# EAGLE design unixtimeclock (EAGLE 6.4)
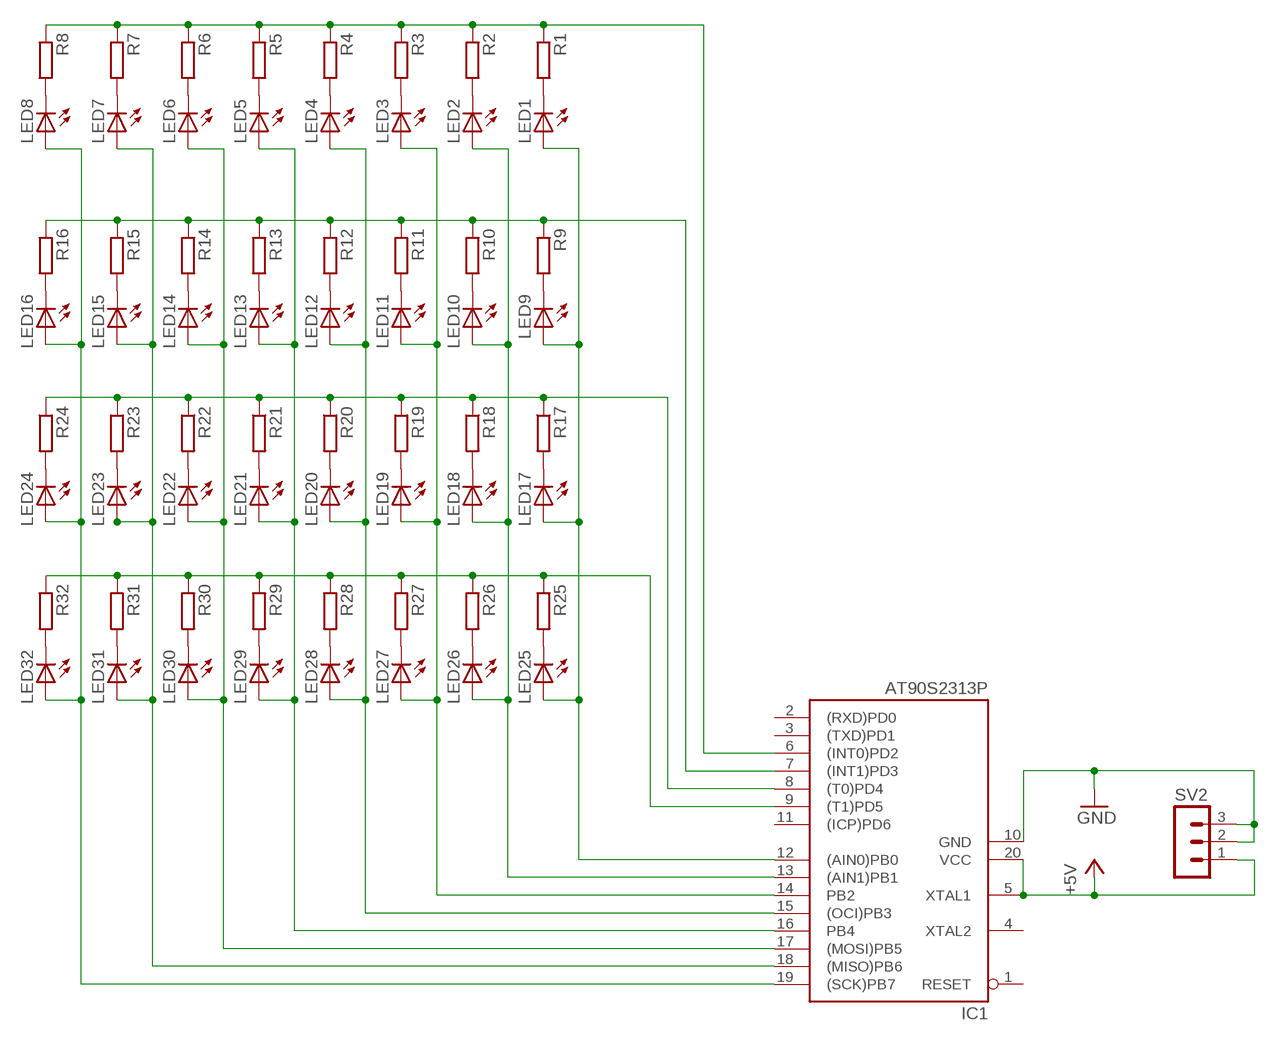
[diagram p0: schematic, sheet 1]

## Parts
IC1  AT90S2313P  [DIL20]
LED1  LED5MM  [LED5MM]
LED2  LED5MM  [LED5MM]
LED3  LED5MM  [LED5MM]
LED4  LED5MM  [LED5MM]
LED5  LED5MM  [LED5MM]
LED6  LED5MM  [LED5MM]
LED7  LED5MM  [LED5MM]
LED8  LED5MM  [LED5MM]
LED9  LED5MM  [LED5MM]
LED10  LED5MM  [LED5MM]
LED11  LED5MM  [LED5MM]
LED12  LED5MM  [LED5MM]
LED13  LED5MM  [LED5MM]
LED14  LED5MM  [LED5MM]
LED15  LED5MM  [LED5MM]
LED16  LED5MM  [LED5MM]
LED17  LED5MM  [LED5MM]
LED18  LED5MM  [LED5MM]
LED19  LED5MM  [LED5MM]
LED20  LED5MM  [LED5MM]
LED21  LED5MM  [LED5MM]
LED22  LED5MM  [LED5MM]
LED23  LED5MM  [LED5MM]
LED24  LED5MM  [LED5MM]
LED25  LED5MM  [LED5MM]
LED26  LED5MM  [LED5MM]
LED27  LED5MM  [LED5MM]
LED28  LED5MM  [LED5MM]
LED29  LED5MM  [LED5MM]
LED30  LED5MM  [LED5MM]
LED31  LED5MM  [LED5MM]
LED32  LED5MM  [LED5MM]
R1  R-EU_0207/10  [0207/10]
R2  R-EU_0207/10  [0207/10]
R3  R-EU_0207/10  [0207/10]
R4  R-EU_0207/10  [0207/10]
R5  R-EU_0207/10  [0207/10]
R6  R-EU_0207/10  [0207/10]
R7  R-EU_0207/10  [0207/10]
R8  R-EU_0207/10  [0207/10]
R9  R-EU_0207/10  [0207/10]
R10  R-EU_0207/10  [0207/10]
R11  R-EU_0207/10  [0207/10]
R12  R-EU_0207/10  [0207/10]
R13  R-EU_0207/10  [0207/10]
R14  R-EU_0207/10  [0207/10]
R15  R-EU_0207/10  [0207/10]
R16  R-EU_0207/10  [0207/10]
R17  R-EU_0207/10  [0207/10]
R18  R-EU_0207/10  [0207/10]
R19  R-EU_0207/10  [0207/10]
R20  R-EU_0207/10  [0207/10]
R21  R-EU_0207/10  [0207/10]
R22  R-EU_0207/10  [0207/10]
R23  R-EU_0207/10  [0207/10]
R24  R-EU_0207/10  [0207/10]
R25  R-EU_0207/10  [0207/10]
R26  R-EU_0207/10  [0207/10]
R27  R-EU_0207/10  [0207/10]
R28  R-EU_0207/10  [0207/10]
R29  R-EU_0207/10  [0207/10]
R30  R-EU_0207/10  [0207/10]
R31  R-EU_0207/10  [0207/10]
R32  R-EU_0207/10  [0207/10]
SV2  MA03-1  [MA03-1]

## Nets
+5V: IC1.5(XTAL1) IC1.20(VCC) SV2.1
GND: IC1.10(GND) SV2.2 SV2.3
N$1: LED25.K(C) R25.2
N$2: LED26.K(C) R26.2
N$3: LED27.K(C) R27.2
N$4: LED28.K(C) R28.2
N$5: LED29.K(C) R29.2
N$6: LED30.K(C) R30.2
N$7: LED31.K(C) R31.2
N$8: LED32.K(C) R32.2
N$9: LED17.K(C) R17.2
N$10: LED18.K(C) R18.2
N$11: LED19.K(C) R19.2
N$12: LED20.K(C) R20.2
N$13: LED21.K(C) R21.2
N$14: LED22.K(C) R22.2
N$15: LED23.K(C) R23.2
N$16: LED24.K(C) R24.2
N$17: IC1.6((INT0)PD2) R1.1 R2.1 R3.1 R4.1 R5.1 R6.1 R7.1 R8.1
N$18: LED9.K(C) R9.2
N$19: LED10.K(C) R10.2
N$20: LED11.K(C) R11.2
N$21: LED12.K(C) R12.2
N$22: LED13.K(C) R13.2
N$23: LED14.K(C) R14.2
N$24: LED15.K(C) R15.2
N$25: LED16.K(C) R16.2
N$26: LED1.K(C) R1.2
N$27: LED2.K(C) R2.2
N$28: LED3.K(C) R3.2
N$29: LED4.K(C) R4.2
N$30: LED5.K(C) R5.2
N$31: LED6.K(C) R6.2
N$32: LED7.K(C) R7.2
N$33: LED8.K(C) R8.2
N$34: IC1.7((INT1)PD3) R9.1 R10.1 R11.1 R12.1 R13.1 R14.1 R15.1 R16.1
N$35: IC1.8((T0)PD4) R17.1 R18.1 R19.1 R20.1 R21.1 R22.1 R23.1 R24.1
N$36: IC1.9((T1)PD5) R25.1 R26.1 R27.1 R28.1 R29.1 R30.1 R31.1 R32.1
N$37: IC1.19((SCK)PB7) LED8.A LED16.A LED24.A LED32.A
N$39: IC1.17((MOSI)PB5) LED6.A LED14.A LED22.A LED30.A
N$40: IC1.16(PB4) LED5.A LED13.A LED21.A LED29.A
N$41: IC1.15((OCI)PB3) LED4.A LED12.A LED20.A LED28.A
N$42: IC1.14(PB2) LED3.A LED11.A LED19.A LED27.A
N$43: IC1.13((AIN1)PB1) LED2.A LED10.A LED18.A LED26.A
N$44: IC1.12((AIN0)PB0) LED1.A LED9.A LED17.A LED25.A
N$68: IC1.18((MISO)PB6) LED7.A LED15.A LED23.A LED31.A
Unconnected: IC1.1(RESET) IC1.2((RXD)PD0) IC1.3((TXD)PD1) IC1.4(XTAL2) IC1.11((ICP)PD6)

## Library data of the parts
IC1 = atmel:AT90S2313: MICROCONTROLLER 2 Kbytes FLASH 128 bytes SRAM 128 bytes EEPROM UART; OC_FARNELL: unknown; OC_NEWARK: unknown
LED1-LED32 = led:LED: LED OSRAM: - CHIPLED LG R971, LG N971, LY N971, LG Q971, LY Q971, LO R971, LY R971 LH N974, LH R974 LS Q976, LO Q976, LY Q976 LO Q996 - Hyper CHIPLED LW Q18S LB Q993, LB Q99A, LB R99A - SideLED LS A670, LO A670, LY A670, LG A670, LP A670 LB A673, LV A673, LT A673, LW A673 LH A674 LY A675 LS A676, LA A676, LO A676, LY A676, LW A676 LS A679, LY A679, LG A679 - Hyper Micro SIDELED® LS Y876, LA Y876, LO Y876, LY Y876 LT Y87S - SmartLED LW L88C, LW L88S LB L89C, LB L89S, LG L890 LS L89K, LO L89K, LY L89K LS L896, LA L896, LO L896, LY L896 - TOPLED LS T670, LO T670, LY T670, LG T670, LP T670 LSG T670, LSP T670, LSY T670, LOP T670, LYG T670 LG T671, LOG T671, LSG T671 LB T673, LV T673, LT T673, LW T673 LH T674 LS T676, LA T676, LO T676, LY T676, LB T676, LH T676, LSB T676, LW T676 LB T67C, LV T67C, LT T67C, LS T67K, LO T67K, LY T67K, LW E67C LS E67B, LA E67B, LO E67B, LY E67B, LB E67C, LV E67C, LT E67C LW T67C LS T679, LY T679, LG T679 LS T770, LO T770, LY T770, LG T770, LP T770 LB T773, LV T773, LT T773, LW T773 LH T774 LS E675, LA E675, LY E675, LS T675 LS T776, LA T776, LO T776, LY T776, LB T776 LHGB T686 LT T68C, LB T68C - Hyper Mini TOPLED® LB M676 - Mini TOPLED Santana® LG M470 LS M47K, LO M47K, LY M47K Source: http://www.osram.convergy.de LUXEON: - LUMILED® LXK2-PW12-R00, LXK2-PW12-S00, LXK2-PW14-U00, LXK2-PW14-V00 LXK2-PM12-R00, LXK2-PM12-S00, LXK2-PM14-U00 LXK2-PE12-Q00, LXK2-PE12-R00, LXK2-PE12-S00, LXK2-PE14-T00, LXK2-PE14-U00 LXK2-PB12-K00, LXK2-PB12-L00, LXK2-PB12-M00, LXK2-PB14-N00, LXK2-PB14-P00, LXK2-PB14-Q00 LXK2-PR12-L00, LXK2-PR12-M00, LXK2-PR14-Q00, LXK2-PR14-R00 LXK2-PD12-Q00, LXK2-PD12-R00, LXK2-PD12-S00 LXK2-PH12-R00, LXK2-PH12-S00 LXK2-PL12-P00, LXK2-PL12-Q00, LXK2-PL12-R00 Source: www.luxeon.com KINGBRIGHT: KA-3528ASYC Source: www.kingbright.com
R1-R32 = rcl:R-EU_: RESISTOR, European symbol
SV2 = con-lstb:MA03-1: PIN HEADER; OC_FARNELL: unknown; OC_NEWARK: unknown

## Board
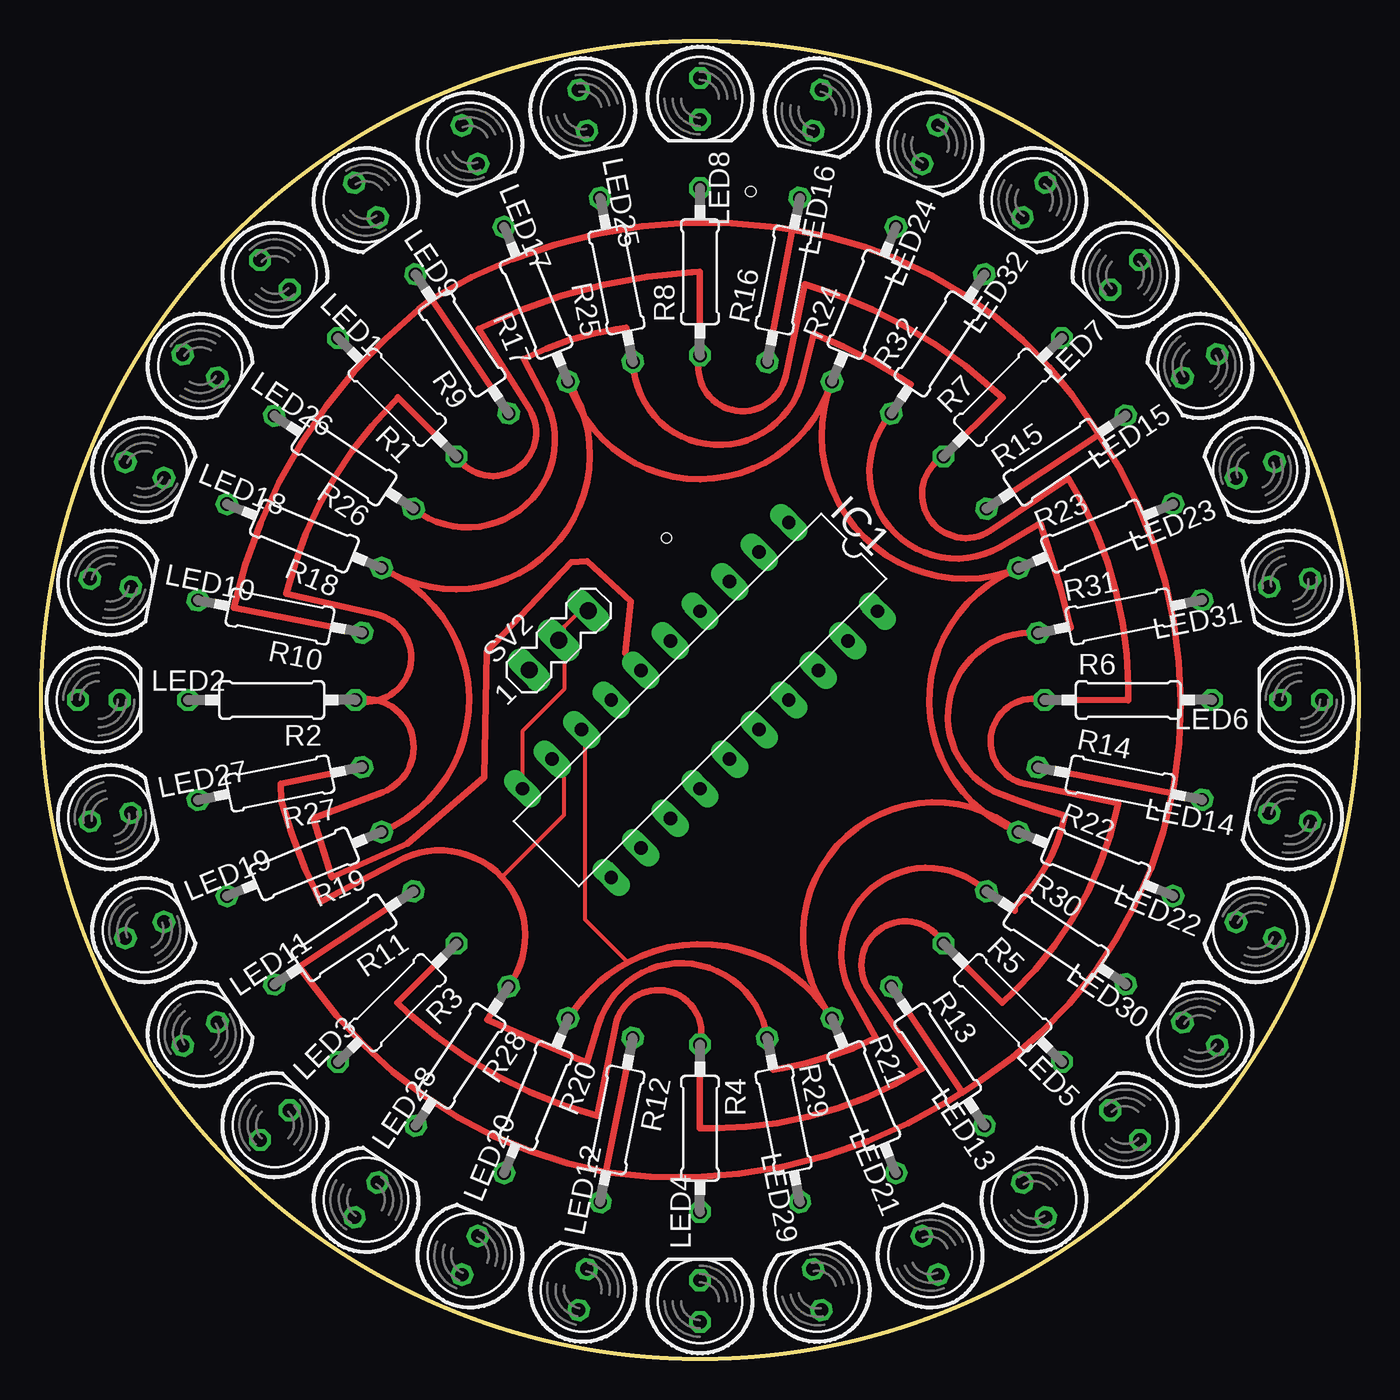
[diagram p1: board, top side]
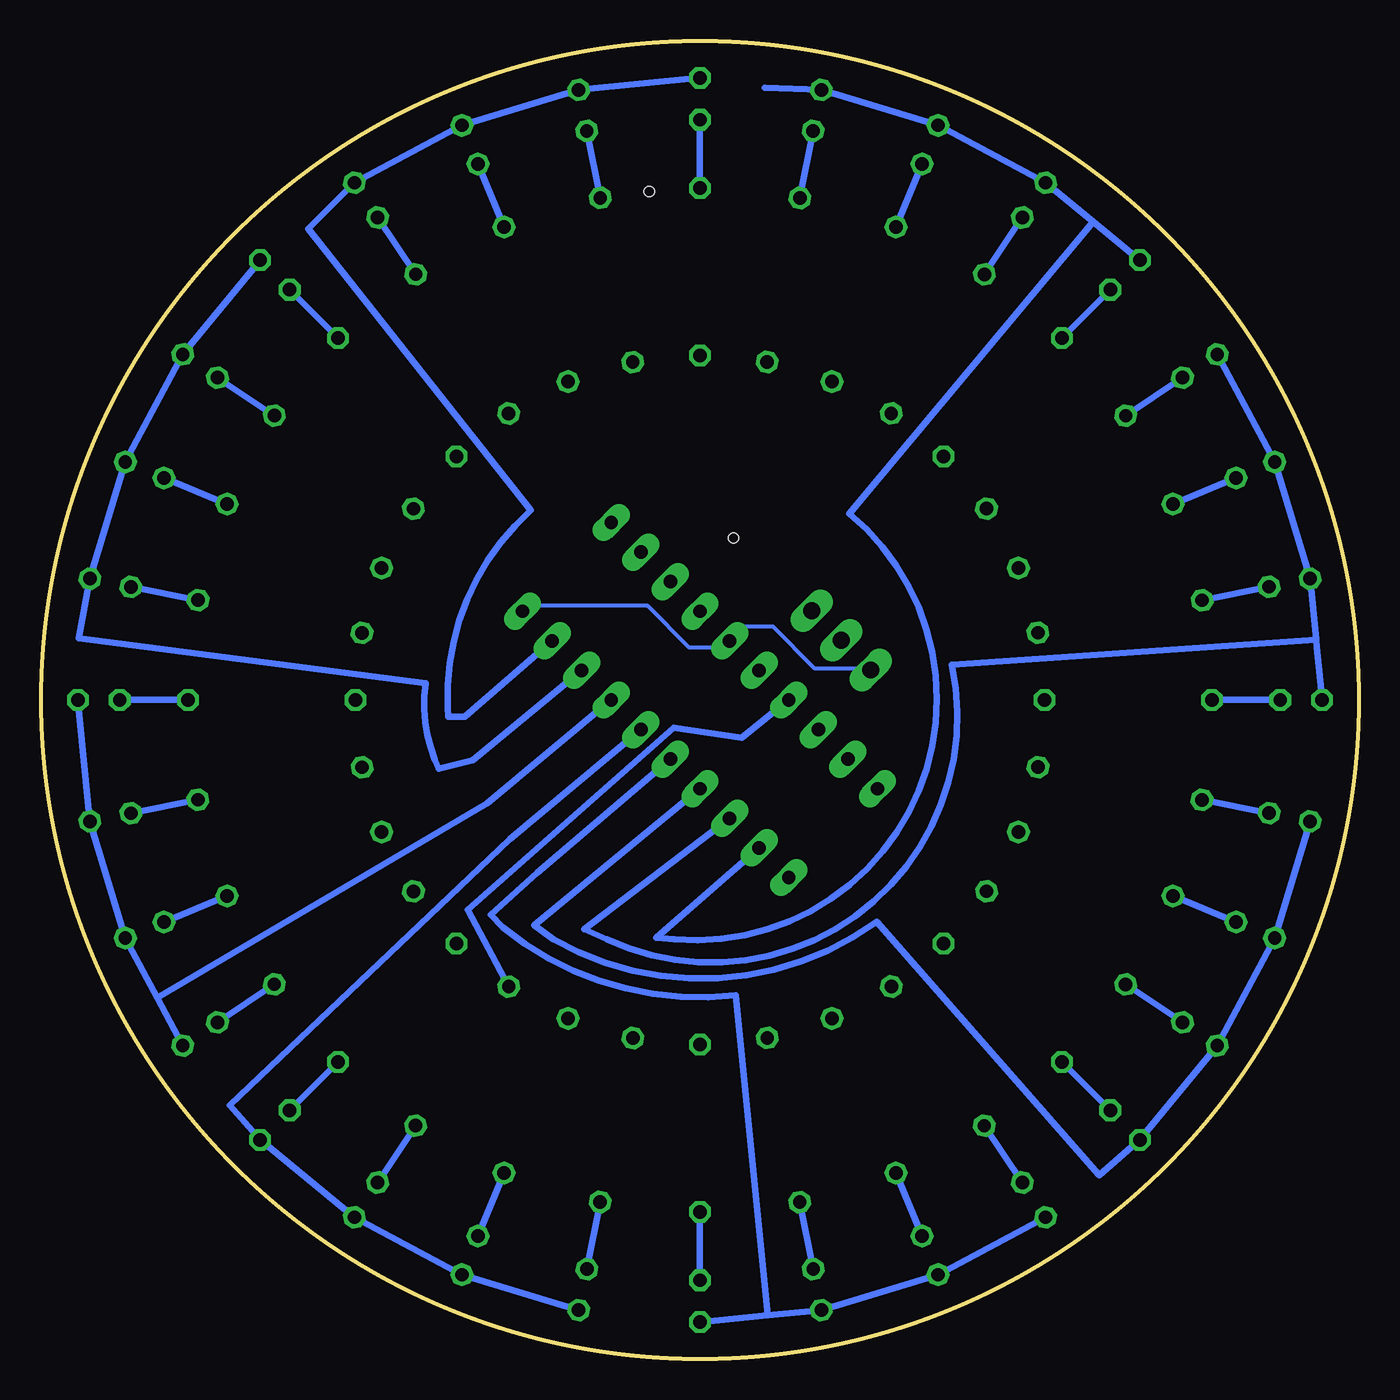
[diagram p2: board, bottom side, seen from below]

Size 80 x 80 mm. Coordinates in mm from the lower left corner, seen from the top.
Outline: circle at 40,40 radius 40
Copper layers (1*16): Top 0.035mm / dielectric 1.5mm / Bottom 0.035mm
Design rules "default": minimum track width 10mil, minimum drill 24mil, track to track 8mil, track to pad 8mil, pad to pad 8mil, via to via 8mil, smd to smd 8mil, copper to edge 40mil, drill to drill 8mil, minimum pad ring 10mil, minimum via ring 8mil, stop-mask expansion 4mil, vias tented up to drill 0mil, thermal gap 10mil
Holes 0.6 mm at 37.96,49.84 43.08,70.88

### Footprints (pad centres in the part's own frame; a part is rotated, then mirrored left to right if it is on the bottom)
DIL20 = drill 0.813 long: 1 -11.43,-3.81; 2 -8.89,-3.81; 3 -6.35,-3.81; 4 -3.81,-3.81; 5 -1.27,-3.81; 6 1.27,-3.81; 7 3.81,-3.81; 8 6.35,-3.81; 9 8.89,-3.81; 10 11.43,-3.81; 11 11.43,3.81; 12 8.89,3.81; 13 6.35,3.81; 14 3.81,3.81; 15 1.27,3.81; 16 -1.27,3.81; 17 -3.81,3.81; 18 -6.35,3.81; 19 -8.89,3.81; 20 -11.43,3.81
LED5MM = drill 0.813 octagon: A -1.27,0; K 1.27,0
0207/10 = drill 0.813 octagon: 1 -5.08,0; 2 5.08,0
MA03-1 = drill 1.016 long: 1 -2.54,0; 2 0,0; 3 2.54,0

### Placement (x,y rotation side)
IC1  40,40 225 top
LED1  14.19,65.81 315 top
LED2  3.5,40 0 top
LED3  14.19,14.19 45 top
LED4  40,3.5 90 top
LED5  65.81,14.19 135 top
LED6  76.5,40 180 top
LED7  65.81,65.81 225 top
LED8  40,76.5 270 top
LED9  19.72,70.35 303.8 top
LED10  4.2,47.12 348.8 top
LED11  9.65,19.72 33.8 top
LED12  32.88,4.2 78.8 top
LED13  60.28,9.65 123.8 top
LED14  75.8,32.88 168.8 top
LED15  70.35,60.28 213.8 top
LED16  47.12,75.8 258.8 top
LED17  26.03,73.72 292.5 top
LED18  6.28,53.97 337.5 top
LED19  6.28,26.03 22.5 top
LED20  26.03,6.28 67.5 top
LED21  53.97,6.28 112.5 top
LED22  73.72,26.03 157.5 top
LED23  73.72,53.97 202.5 top
LED24  53.97,73.72 247.5 top
LED25  32.88,75.8 281.3 top
LED26  9.65,60.28 326.3 top
LED27  4.2,32.88 11.3 top
LED28  19.72,9.65 56.3 top
LED29  47.12,4.2 101.3 top
LED30  70.35,19.72 146.3 top
LED31  75.8,47.12 191.3 top
LED32  60.28,70.35 236.3 top
R1  21.62,58.38 135 top
R2  14,40 180 top
R3  21.62,21.62 225 top
R4  40,14 270 top
R5  58.38,21.62 315 top
R6  66,40 0 top
R7  58.38,58.38 45 top
R8  40,66 90 top
R9  25.56,61.62 123.8 top
R10  14.5,45.07 168.8 top
R11  18.38,25.56 213.8 top
R12  34.93,14.5 258.8 top
R13  54.44,18.38 303.8 top
R14  65.5,34.93 348.8 top
R15  61.62,54.44 33.8 top
R16  45.07,65.5 78.8 top
R17  30.05,64.02 112.5 top
R18  15.98,49.95 157.5 top
R19  15.98,30.05 202.5 top
R20  30.05,15.98 247.5 top
R21  49.95,15.98 292.5 top
R22  64.02,30.05 337.5 top
R23  64.02,49.95 22.5 top
R24  49.95,64.02 67.5 top
R25  34.93,65.5 101.3 top
R26  18.38,54.44 146.3 top
R27  14.5,34.93 191.3 top
R28  25.56,18.38 236.3 top
R29  45.07,14.5 281.3 top
R30  61.62,25.56 326.3 top
R31  65.5,45.07 11.3 top
R32  54.44,61.62 56.3 top
SV2  31.42,43.62 45 top

### Tracks (layer width: path | path; a pad name or v marks a point on that pad's centre or on a via)
+5V
  Bottom 0.254: SV2.1 30.48,41.91 33.02,41.91 35.56,44.45 38.1,44.45 IC1.5 38.1,43.18 40.64,43.18 43.18,45.72 50.8,45.72 IC1.20
GND
  Top 0.254: 31.75,43.18 31.75,40.64 29.21,38.1 29.21,34.29 IC1.10 | 31.75,43.18 31.75,44.45 33.02,45.72 SV2.3 | 31.75,43.18 SV2.2
N$1
  Bottom 0.406: R25.2 LED25.K
N$2
  Bottom 0.406: LED26.K R26.2
N$3
  Bottom 0.406: LED27.K R27.2
N$4
  Bottom 0.406: LED28.K R28.2
N$5
  Bottom 0.406: LED29.K R29.2
N$6
  Bottom 0.406: R30.2 LED30.K
N$7
  Bottom 0.406: R31.2 LED31.K
N$8
  Bottom 0.406: LED32.K R32.2
N$9
  Bottom 0.406: R17.2 LED17.K
N$10
  Bottom 0.406: LED18.K R18.2
N$11
  Bottom 0.406: R19.2 LED19.K
N$12
  Bottom 0.406: LED20.K R20.2
N$13
  Bottom 0.406: R21.2 LED21.K
N$14
  Bottom 0.406: R22.2 LED22.K
N$15
  Bottom 0.406: R23.2 LED23.K
N$16
  Bottom 0.406: R24.2 LED24.K
N$17
  Top 0.254: 21.59,40.64 21.61,40.62
  Top 0.406: R3.1 21.61,21.62 22.3,20.98 arc28 33.77,14.77 34.89,20.29 arc-184 R4.1 40,14 40.9,14 arc32 53.52,17.65 50.27,22.38 arc-185 R5.1 54.79,25.17 58.35,21.61 59.02,22.25 arc35 65.39,33.73 59.72,34.92 arc-183 R6.1 66.01,40 66,40.9 arc31 62.35,53.48 57.63,50.29 arc-183 R7.1 58.37,58.35 57.78,58.88 arc25 46.37,65.24 45.19,59.66 arc-184 R8.1 39.98,66.01 39.48,65.98 arc23 26.58,62.54 29.65,57.64 arc-179 R1.1 25.21,54.82 21.65,58.38 21.65,58.32 21.4,58.07 arc32 14.89,46.44 20.38,45.2 arc-124 21.61,40.62 arc-58 R2.1 arc-171 20.73,34.41 16.53,32.81 17.64,29.23 22.22,31.28 26.91,35.31 27.06,42.94 32.2,48.38 33.16,48.41 35.81,45.99 35.47,42.83 IC1.6
N$18
  Bottom 0.406: R9.2 LED9.K
N$19
  Bottom 0.406: LED10.K R10.2
N$20
  Bottom 0.406: LED11.K R11.2
N$21
  Bottom 0.406: LED12.K R12.2
N$22
  Bottom 0.406: R13.2 LED13.K
N$23
  Bottom 0.406: R14.2 LED14.K
N$24
  Bottom 0.406: R15.2 LED15.K
N$25
  Bottom 0.406: R16.2 LED16.K
N$26
  Bottom 0.406: LED1.K R1.2
N$27
  Bottom 0.406: LED2.K R2.2
N$28
  Bottom 0.406: LED3.K R3.2
N$29
  Bottom 0.406: R4.2 LED4.K
N$30
  Bottom 0.406: R5.2 LED5.K
N$31
  Bottom 0.406: R6.2 LED6.K
N$32
  Bottom 0.406: LED7.K R7.2
N$33
  Bottom 0.406: R8.2 LED8.K
N$34
  Top 0.406: R10.1 11.69,45.6 arc-38 22.94,63.71 23.72,64.33 R9.1 23.73,64.34 arc-39 44.63,68.69 45.6,68.56 R16.1 45.59,68.56 arc-50 63.88,56.64 64.22,56.11 R15.1 64.22,56.11 arc-43 68.78,34.95 68.68,34.33 R14.1 68.68,34.34 arc-46 57,16.87 55.93,16.16 R13.1 55.93,16.17 55.01,15.61 arc-39 34.29,11.33 | R11.1 15.68,23.82 16.45,22.73 arc44 34.29,11.33 | 34.29,11.33 R12.1
  Bottom 0.254: 52.07,22.86 R13.1
  Bottom 0.406: IC1.7 37.48,37.71 41.6,38.3 54.1,27.25 R13.1
N$35
  Top 0.254: IC1.8 33.02,38.1 33.02,26.67 35.56,24.13 35.6,24.06
  Top 0.406: R20.1 32.49,21.35 arc-26 35.6,24.06 arc-87 R21.1 47.52,21.43 arc-162 R22.1 arc-133 58.91,47.81 | R23.1 58.91,47.81 | 58.91,47.81 58.68,47.74 arc-129 R24.1 47.72,58.62 arc-141 R17.1 arc-151 21.39,47.65 21.12,47.79 | 21.04,32.13 R19.1 arc131 21.12,47.79 | R18.1 21.12,47.79
N$36
  Top 0.254: IC1.9 31.75,35.56 31.75,33.02 27.94,29.21 27.98,29.24
  Top 0.406: R26.1 arc156 30.6,58.22 29.3,60.72 arc-18 34.93,62.51 35.51,62.6 R25.1 arc164 46.21,59.44 46.9,62.23 arc-11 52.21,59.54 52.8,59.17 R32.1 arc162 58.25,49.31 60.67,50.72 arc-4 62.42,44.69 62.5,44.39 R31.1 arc163 58.3,34.27 arc4 61.69,33.11 62.14,32.98 arc-34 59.33,27.7 59.1,27.48 59.1,27.21 R30.1 arc162 49.23,22.07 50.66,19.48 arc-17 44.99,17.65 44.45,17.56 R29.1 arc155 33.83,20.28 33.13,17.97 27.07,20.6 R28.1 arc80 27.98,29.24 arc72 22,30.39 16.96,27.74 arc-10 14.59,33.87 14.53,34.9 R27.1
N$37
  Bottom 0.406: LED8.A LED16.A LED24.A LED32.A 63.77,68.61 50.26,51.53 arc-51 55.31,39.54 55.28,38.97 54.28,38.97 IC1.19
N$39
  Bottom 0.406: LED6.A LED14.A LED22.A 72.96,21.92 | LED30.A 72.96,21.92 | IC1.17 52.93,33.74 72.96,21.92
N$40
  Bottom 0.406: LED29.A LED21.A LED13.A LED5.A 68.54,15.39 51.54,31.54 IC1.16
N$41
  Bottom 0.406: LED4.A 35.88,2.63 | 35.88,2.63 LED12.A LED20.A LED28.A | IC1.15 49.87,29.5 52.7,26.95 51.99,26.21 arc-46 37.82,22.08 35.88,2.63
N$42
  Bottom 0.406: LED27.A LED19.A LED11.A LED3.A 15.77,11.16 29.26,26.54 arc66 48.91,25.47 50.06,26.34 IC1.14
N$43
  Bottom 0.406: LED2.A 2.55,43.22 2.59,43.66 | 2.59,43.66 LED10.A LED18.A LED26.A | IC1.13 47.04,26.09 45.66,25.47 arc-127 24.71,42.14 2.59,43.66
N$44
  Bottom 0.406: LED1.A 16.13,69.04 | 16.13,69.04 LED9.A LED17.A LED25.A 36.05,77.17 | IC1.12 42.66,25.56 41.56,25.47 arc-146 30.94,51.32 16.13,69.04
N$68
  Bottom 0.406: LED7.A LED15.A LED23.A LED31.A 77.72,43.76 56.65,41 arc-30 56.09,36.39 55.87,35.83 53.79,36.35 IC1.18